# Altium schematic sheet LEDs.SchDoc
size A2
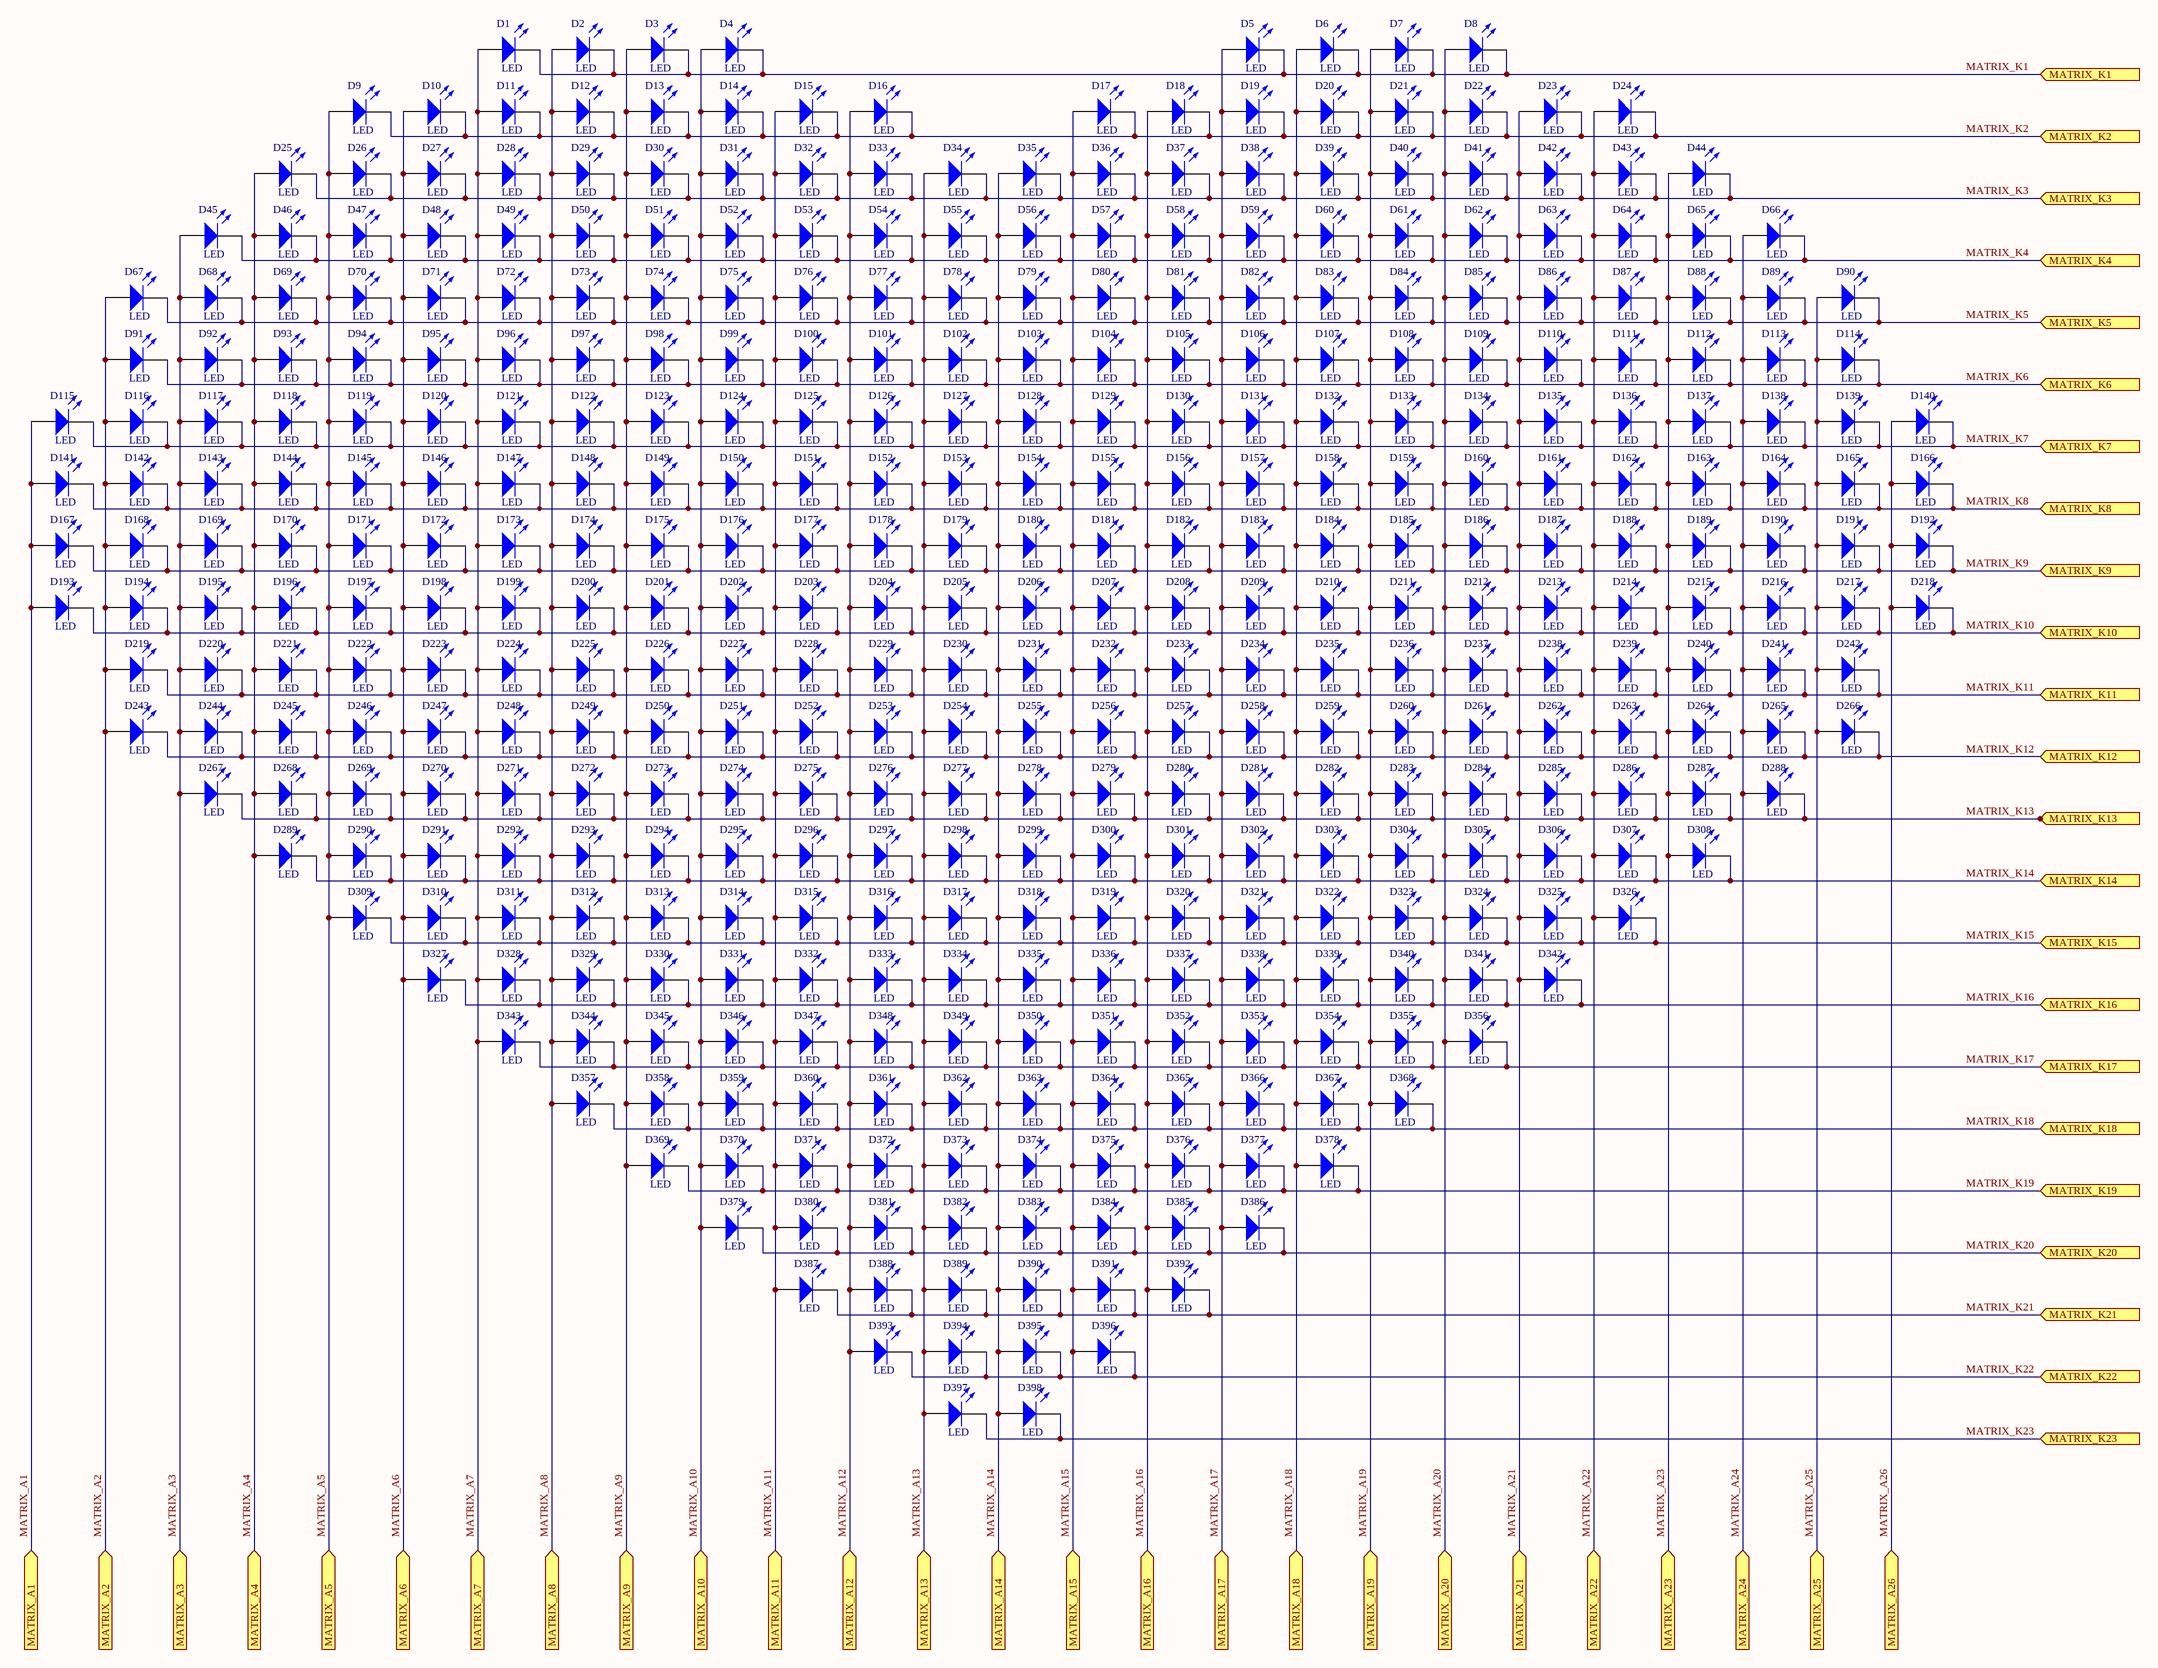
[diagram p0: LEDs.SchDoc]

## Parts
D1  LED  [led_3mm]
D2  LED  [led_3mm]
D3  LED  [led_3mm]
D4  LED  [led_3mm]
D5  LED  [led_3mm]
D6  LED  [led_3mm]
D7  LED  [led_3mm]
D8  LED  [led_3mm]
D9  LED  [led_3mm]
D10  LED  [led_3mm]
D11  LED  [led_3mm]
D12  LED  [led_3mm]
D13  LED  [led_3mm]
D14  LED  [led_3mm]
D15  LED  [led_3mm]
D16  LED  [led_3mm]
D17  LED  [led_3mm]
D18  LED  [led_3mm]
D19  LED  [led_3mm]
D20  LED  [led_3mm]
D21  LED  [led_3mm]
D22  LED  [led_3mm]
D23  LED  [led_3mm]
D24  LED  [led_3mm]
D25  LED  [led_3mm]
D26  LED  [led_3mm]
D27  LED  [led_3mm]
D28  LED  [led_3mm]
D29  LED  [led_3mm]
D30  LED  [led_3mm]
D31  LED  [led_3mm]
D32  LED  [led_3mm]
D33  LED  [led_3mm]
D34  LED  [led_3mm]
D35  LED  [led_3mm]
D36  LED  [led_3mm]
D37  LED  [led_3mm]
D38  LED  [led_3mm]
D39  LED  [led_3mm]
D40  LED  [led_3mm]
D41  LED  [led_3mm]
D42  LED  [led_3mm]
D43  LED  [led_3mm]
D44  LED  [led_3mm]
D45  LED  [led_3mm]
D46  LED  [led_3mm]
D47  LED  [led_3mm]
D48  LED  [led_3mm]
D49  LED  [led_3mm]
D50  LED  [led_3mm]
D51  LED  [led_3mm]
D52  LED  [led_3mm]
D53  LED  [led_3mm]
D54  LED  [led_3mm]
D55  LED  [led_3mm]
D56  LED  [led_3mm]
D57  LED  [led_3mm]
D58  LED  [led_3mm]
D59  LED  [led_3mm]
D60  LED  [led_3mm]
D61  LED  [led_3mm]
D62  LED  [led_3mm]
D63  LED  [led_3mm]
D64  LED  [led_3mm]
D65  LED  [led_3mm]
D66  LED  [led_3mm]
D67  LED  [led_3mm]
D68  LED  [led_3mm]
D69  LED  [led_3mm]
D70  LED  [led_3mm]
D71  LED  [led_3mm]
D72  LED  [led_3mm]
D73  LED  [led_3mm]
D74  LED  [led_3mm]
D75  LED  [led_3mm]
D76  LED  [led_3mm]
D77  LED  [led_3mm]
D78  LED  [led_3mm]
D79  LED  [led_3mm]
D80  LED  [led_3mm]
D81  LED  [led_3mm]
D82  LED  [led_3mm]
D83  LED  [led_3mm]
D84  LED  [led_3mm]
D85  LED  [led_3mm]
D86  LED  [led_3mm]
D87  LED  [led_3mm]
D88  LED  [led_3mm]
D89  LED  [led_3mm]
D90  LED  [led_3mm]
D91  LED  [led_3mm]
D92  LED  [led_3mm]
D93  LED  [led_3mm]
D94  LED  [led_3mm]
D95  LED  [led_3mm]
D96  LED  [led_3mm]
D97  LED  [led_3mm]
D98  LED  [led_3mm]
D99  LED  [led_3mm]
D100  LED  [led_3mm]
D101  LED  [led_3mm]
D102  LED  [led_3mm]
D103  LED  [led_3mm]
D104  LED  [led_3mm]
D105  LED  [led_3mm]
D106  LED  [led_3mm]
D107  LED  [led_3mm]
D108  LED  [led_3mm]
D109  LED  [led_3mm]
D110  LED  [led_3mm]
D111  LED  [led_3mm]
D112  LED  [led_3mm]
D113  LED  [led_3mm]
D114  LED  [led_3mm]
D115  LED  [led_3mm]
D116  LED  [led_3mm]
D117  LED  [led_3mm]
D118  LED  [led_3mm]
D119  LED  [led_3mm]
D120  LED  [led_3mm]
D121  LED  [led_3mm]
D122  LED  [led_3mm]
D123  LED  [led_3mm]
D124  LED  [led_3mm]
D125  LED  [led_3mm]
D126  LED  [led_3mm]
D127  LED  [led_3mm]
D128  LED  [led_3mm]
D129  LED  [led_3mm]
D130  LED  [led_3mm]
D131  LED  [led_3mm]
D132  LED  [led_3mm]
D133  LED  [led_3mm]
D134  LED  [led_3mm]
D135  LED  [led_3mm]
D136  LED  [led_3mm]
D137  LED  [led_3mm]
D138  LED  [led_3mm]
D139  LED  [led_3mm]
D140  LED  [led_3mm]
D141  LED  [led_3mm]
D142  LED  [led_3mm]
D143  LED  [led_3mm]
D144  LED  [led_3mm]
D145  LED  [led_3mm]
D146  LED  [led_3mm]
D147  LED  [led_3mm]
D148  LED  [led_3mm]
D149  LED  [led_3mm]
D150  LED  [led_3mm]
D151  LED  [led_3mm]
D152  LED  [led_3mm]
D153  LED  [led_3mm]
D154  LED  [led_3mm]
D155  LED  [led_3mm]
D156  LED  [led_3mm]
D157  LED  [led_3mm]
D158  LED  [led_3mm]
D159  LED  [led_3mm]
D160  LED  [led_3mm]
D161  LED  [led_3mm]
D162  LED  [led_3mm]
D163  LED  [led_3mm]
D164  LED  [led_3mm]
D165  LED  [led_3mm]
D166  LED  [led_3mm]
D167  LED  [led_3mm]
D168  LED  [led_3mm]
D169  LED  [led_3mm]
D170  LED  [led_3mm]
D171  LED  [led_3mm]
D172  LED  [led_3mm]
D173  LED  [led_3mm]
D174  LED  [led_3mm]
D175  LED  [led_3mm]
D176  LED  [led_3mm]
D177  LED  [led_3mm]
D178  LED  [led_3mm]
D179  LED  [led_3mm]
D180  LED  [led_3mm]
D181  LED  [led_3mm]
D182  LED  [led_3mm]
D183  LED  [led_3mm]
D184  LED  [led_3mm]
D185  LED  [led_3mm]
D186  LED  [led_3mm]
D187  LED  [led_3mm]
D188  LED  [led_3mm]
D189  LED  [led_3mm]
D190  LED  [led_3mm]
D191  LED  [led_3mm]
D192  LED  [led_3mm]
D193  LED  [led_3mm]
D194  LED  [led_3mm]
D195  LED  [led_3mm]
D196  LED  [led_3mm]
D197  LED  [led_3mm]
D198  LED  [led_3mm]
D199  LED  [led_3mm]
D200  LED  [led_3mm]
D201  LED  [led_3mm]
D202  LED  [led_3mm]
D203  LED  [led_3mm]
D204  LED  [led_3mm]
D205  LED  [led_3mm]
D206  LED  [led_3mm]
D207  LED  [led_3mm]
D208  LED  [led_3mm]
D209  LED  [led_3mm]
D210  LED  [led_3mm]
D211  LED  [led_3mm]
D212  LED  [led_3mm]
D213  LED  [led_3mm]
D214  LED  [led_3mm]
D215  LED  [led_3mm]
D216  LED  [led_3mm]
D217  LED  [led_3mm]
D218  LED  [led_3mm]
D219  LED  [led_3mm]
D220  LED  [led_3mm]
D221  LED  [led_3mm]
D222  LED  [led_3mm]
D223  LED  [led_3mm]
D224  LED  [led_3mm]
D225  LED  [led_3mm]
D226  LED  [led_3mm]
D227  LED  [led_3mm]
D228  LED  [led_3mm]
D229  LED  [led_3mm]
D230  LED  [led_3mm]
D231  LED  [led_3mm]
D232  LED  [led_3mm]
D233  LED  [led_3mm]
D234  LED  [led_3mm]
D235  LED  [led_3mm]
D236  LED  [led_3mm]
D237  LED  [led_3mm]
D238  LED  [led_3mm]
D239  LED  [led_3mm]
D240  LED  [led_3mm]
D241  LED  [led_3mm]
D242  LED  [led_3mm]
D243  LED  [led_3mm]
D244  LED  [led_3mm]
D245  LED  [led_3mm]
D246  LED  [led_3mm]
D247  LED  [led_3mm]
D248  LED  [led_3mm]
D249  LED  [led_3mm]
D250  LED  [led_3mm]
D251  LED  [led_3mm]
D252  LED  [led_3mm]
D253  LED  [led_3mm]
D254  LED  [led_3mm]
D255  LED  [led_3mm]
D256  LED  [led_3mm]
D257  LED  [led_3mm]
D258  LED  [led_3mm]
D259  LED  [led_3mm]
D260  LED  [led_3mm]
D261  LED  [led_3mm]
D262  LED  [led_3mm]
D263  LED  [led_3mm]
D264  LED  [led_3mm]
D265  LED  [led_3mm]
D266  LED  [led_3mm]
D267  LED  [led_3mm]
D268  LED  [led_3mm]
D269  LED  [led_3mm]
D270  LED  [led_3mm]
D271  LED  [led_3mm]
D272  LED  [led_3mm]
D273  LED  [led_3mm]
D274  LED  [led_3mm]
D275  LED  [led_3mm]
D276  LED  [led_3mm]
D277  LED  [led_3mm]
D278  LED  [led_3mm]
D279  LED  [led_3mm]
D280  LED  [led_3mm]
D281  LED  [led_3mm]
D282  LED  [led_3mm]
D283  LED  [led_3mm]
D284  LED  [led_3mm]
D285  LED  [led_3mm]
D286  LED  [led_3mm]
D287  LED  [led_3mm]
D288  LED  [led_3mm]
D289  LED  [led_3mm]
D290  LED  [led_3mm]
D291  LED  [led_3mm]
D292  LED  [led_3mm]
D293  LED  [led_3mm]
D294  LED  [led_3mm]
D295  LED  [led_3mm]
D296  LED  [led_3mm]
D297  LED  [led_3mm]
D298  LED  [led_3mm]
D299  LED  [led_3mm]
D300  LED  [led_3mm]
D301  LED  [led_3mm]
D302  LED  [led_3mm]
D303  LED  [led_3mm]
D304  LED  [led_3mm]
D305  LED  [led_3mm]
D306  LED  [led_3mm]
D307  LED  [led_3mm]
D308  LED  [led_3mm]
D309  LED  [led_3mm]
D310  LED  [led_3mm]
D311  LED  [led_3mm]
D312  LED  [led_3mm]
D313  LED  [led_3mm]
D314  LED  [led_3mm]
D315  LED  [led_3mm]
D316  LED  [led_3mm]
D317  LED  [led_3mm]
D318  LED  [led_3mm]
D319  LED  [led_3mm]
D320  LED  [led_3mm]
D321  LED  [led_3mm]
D322  LED  [led_3mm]
D323  LED  [led_3mm]
D324  LED  [led_3mm]
D325  LED  [led_3mm]
D326  LED  [led_3mm]
D327  LED  [led_3mm]
D328  LED  [led_3mm]
D329  LED  [led_3mm]
D330  LED  [led_3mm]
D331  LED  [led_3mm]
D332  LED  [led_3mm]
D333  LED  [led_3mm]
D334  LED  [led_3mm]
D335  LED  [led_3mm]
D336  LED  [led_3mm]
D337  LED  [led_3mm]
D338  LED  [led_3mm]
D339  LED  [led_3mm]
D340  LED  [led_3mm]
D341  LED  [led_3mm]
D342  LED  [led_3mm]
D343  LED  [led_3mm]
D344  LED  [led_3mm]
D345  LED  [led_3mm]
D346  LED  [led_3mm]
D347  LED  [led_3mm]
D348  LED  [led_3mm]
D349  LED  [led_3mm]
D350  LED  [led_3mm]
D351  LED  [led_3mm]
D352  LED  [led_3mm]
D353  LED  [led_3mm]
D354  LED  [led_3mm]
D355  LED  [led_3mm]
D356  LED  [led_3mm]
D357  LED  [led_3mm]
D358  LED  [led_3mm]
D359  LED  [led_3mm]
D360  LED  [led_3mm]
D361  LED  [led_3mm]
D362  LED  [led_3mm]
D363  LED  [led_3mm]
D364  LED  [led_3mm]
D365  LED  [led_3mm]
D366  LED  [led_3mm]
D367  LED  [led_3mm]
D368  LED  [led_3mm]
D369  LED  [led_3mm]
D370  LED  [led_3mm]
D371  LED  [led_3mm]
D372  LED  [led_3mm]
D373  LED  [led_3mm]
D374  LED  [led_3mm]
D375  LED  [led_3mm]
D376  LED  [led_3mm]
D377  LED  [led_3mm]
D378  LED  [led_3mm]
D379  LED  [led_3mm]
D380  LED  [led_3mm]
D381  LED  [led_3mm]
D382  LED  [led_3mm]
D383  LED  [led_3mm]
D384  LED  [led_3mm]
D385  LED  [led_3mm]
D386  LED  [led_3mm]
D387  LED  [led_3mm]
D388  LED  [led_3mm]
D389  LED  [led_3mm]
D390  LED  [led_3mm]
D391  LED  [led_3mm]
D392  LED  [led_3mm]
D393  LED  [led_3mm]
D394  LED  [led_3mm]
D395  LED  [led_3mm]
D396  LED  [led_3mm]
D397  LED  [led_3mm]
D398  LED  [led_3mm]

## Ports
MATRIX_A1 (in), MATRIX_A2 (in), MATRIX_A3 (in), MATRIX_A4 (in), MATRIX_A5 (in), MATRIX_A6 (in), MATRIX_A7 (in), MATRIX_A8 (in), MATRIX_A9 (in), MATRIX_A10 (in), MATRIX_A11 (in), MATRIX_A12 (in), MATRIX_A13 (in), MATRIX_A14 (in), MATRIX_A15 (in), MATRIX_A16 (in), MATRIX_A17 (in), MATRIX_A18 (in), MATRIX_A19 (in), MATRIX_A20 (in), MATRIX_A21 (in), MATRIX_A22 (in), MATRIX_A23 (in), MATRIX_A24 (in), MATRIX_A25 (in), MATRIX_A26 (in), MATRIX_K1 (in), MATRIX_K2 (in), MATRIX_K3 (in), MATRIX_K4 (in), MATRIX_K5 (in), MATRIX_K6 (in), MATRIX_K7 (in), MATRIX_K8 (in), MATRIX_K9 (in), MATRIX_K10 (in), MATRIX_K11 (in), MATRIX_K12 (in), MATRIX_K13 (in), MATRIX_K14 (in), MATRIX_K15 (in), MATRIX_K16 (in), MATRIX_K17 (in), MATRIX_K18 (in), MATRIX_K19 (in), MATRIX_K20 (in), MATRIX_K21 (in), MATRIX_K22 (in), MATRIX_K23 (in)

## Nets
MATRIX_A1: D115.A D141.A D167.A D193.A ; port MATRIX_A1
MATRIX_A2: D67.A D91.A D116.A D142.A D168.A D194.A D219.A D243.A ; port MATRIX_A2
MATRIX_A3: D45.A D68.A D92.A D117.A D143.A D169.A D195.A D220.A D244.A D267.A ; port MATRIX_A3
MATRIX_A4: D25.A D46.A D69.A D93.A D118.A D144.A D170.A D196.A D221.A D245.A D268.A D289.A ; port MATRIX_A4
MATRIX_A5: D9.A D26.A D47.A D70.A D94.A D119.A D145.A D171.A D197.A D222.A D246.A D269.A D290.A D309.A ; port MATRIX_A5
MATRIX_A6: D10.A D27.A D48.A D71.A D95.A D120.A D146.A D172.A D198.A D223.A D247.A D270.A D291.A D310.A D327.A ; port MATRIX_A6
MATRIX_A7: D1.A D11.A D28.A D49.A D72.A D96.A D121.A D147.A D173.A D199.A D224.A D248.A D271.A D292.A D311.A D328.A D343.A ; port MATRIX_A7
MATRIX_A8: D2.A D12.A D29.A D50.A D73.A D97.A D122.A D148.A D174.A D200.A D225.A D249.A D272.A D293.A D312.A D329.A D344.A D357.A ; port MATRIX_A8
MATRIX_A9: D3.A D13.A D30.A D51.A D74.A D98.A D123.A D149.A D175.A D201.A D226.A D250.A D273.A D294.A D313.A D330.A D345.A D358.A D369.A ; port MATRIX_A9
MATRIX_A10: D4.A D14.A D31.A D52.A D75.A D99.A D124.A D150.A D176.A D202.A D227.A D251.A D274.A D295.A D314.A D331.A D346.A D359.A D370.A D379.A ; port MATRIX_A10
MATRIX_A11: D15.A D32.A D53.A D76.A D100.A D125.A D151.A D177.A D203.A D228.A D252.A D275.A D296.A D315.A D332.A D347.A D360.A D371.A D380.A D387.A ; port MATRIX_A11
MATRIX_A12: D16.A D33.A D54.A D77.A D101.A D126.A D152.A D178.A D204.A D229.A D253.A D276.A D297.A D316.A D333.A D348.A D361.A D372.A D381.A D388.A D393.A ; port MATRIX_A12
MATRIX_A13: D34.A D55.A D78.A D102.A D127.A D153.A D179.A D205.A D230.A D254.A D277.A D298.A D317.A D334.A D349.A D362.A D373.A D382.A D389.A D394.A D397.A ; port MATRIX_A13
MATRIX_A14: D35.A D56.A D79.A D103.A D128.A D154.A D180.A D206.A D231.A D255.A D278.A D299.A D318.A D335.A D350.A D363.A D374.A D383.A D390.A D395.A D398.A ; port MATRIX_A14
MATRIX_A15: D17.A D36.A D57.A D80.A D104.A D129.A D155.A D181.A D207.A D232.A D256.A D279.A D300.A D319.A D336.A D351.A D364.A D375.A D384.A D391.A D396.A ; port MATRIX_A15
MATRIX_A16: D18.A D37.A D58.A D81.A D105.A D130.A D156.A D182.A D208.A D233.A D257.A D280.A D301.A D320.A D337.A D352.A D365.A D376.A D385.A D392.A ; port MATRIX_A16
MATRIX_A17: D5.A D19.A D38.A D59.A D82.A D106.A D131.A D157.A D183.A D209.A D234.A D258.A D281.A D302.A D321.A D338.A D353.A D366.A D377.A D386.A ; port MATRIX_A17
MATRIX_A18: D6.A D20.A D39.A D60.A D83.A D107.A D132.A D158.A D184.A D210.A D235.A D259.A D282.A D303.A D322.A D339.A D354.A D367.A D378.A ; port MATRIX_A18
MATRIX_A19: D7.A D21.A D40.A D61.A D84.A D108.A D133.A D159.A D185.A D211.A D236.A D260.A D283.A D304.A D323.A D340.A D355.A D368.A ; port MATRIX_A19
MATRIX_A20: D8.A D22.A D41.A D62.A D85.A D109.A D134.A D160.A D186.A D212.A D237.A D261.A D284.A D305.A D324.A D341.A D356.A ; port MATRIX_A20
MATRIX_A21: D23.A D42.A D63.A D86.A D110.A D135.A D161.A D187.A D213.A D238.A D262.A D285.A D306.A D325.A D342.A ; port MATRIX_A21
MATRIX_A22: D24.A D43.A D64.A D87.A D111.A D136.A D162.A D188.A D214.A D239.A D263.A D286.A D307.A D326.A ; port MATRIX_A22
MATRIX_A23: D44.A D65.A D88.A D112.A D137.A D163.A D189.A D215.A D240.A D264.A D287.A D308.A ; port MATRIX_A23
MATRIX_A24: D66.A D89.A D113.A D138.A D164.A D190.A D216.A D241.A D265.A D288.A ; port MATRIX_A24
MATRIX_A25: D90.A D114.A D139.A D165.A D191.A D217.A D242.A D266.A ; port MATRIX_A25
MATRIX_A26: D140.A D166.A D192.A D218.A ; port MATRIX_A26
MATRIX_K1: D1.K D2.K D3.K D4.K D5.K D6.K D7.K D8.K ; port MATRIX_K1
MATRIX_K2: D9.K D10.K D11.K D12.K D13.K D14.K D15.K D16.K D17.K D18.K D19.K D20.K D21.K D22.K D23.K D24.K ; port MATRIX_K2
MATRIX_K3: D25.K D26.K D27.K D28.K D29.K D30.K D31.K D32.K D33.K D34.K D35.K D36.K D37.K D38.K D39.K D40.K D41.K D42.K D43.K D44.K ; port MATRIX_K3
MATRIX_K4: D45.K D46.K D47.K D48.K D49.K D50.K D51.K D52.K D53.K D54.K D55.K D56.K D57.K D58.K D59.K D60.K D61.K D62.K D63.K D64.K D65.K D66.K ; port MATRIX_K4
MATRIX_K5: D67.K D68.K D69.K D70.K D71.K D72.K D73.K D74.K D75.K D76.K D77.K D78.K D79.K D80.K D81.K D82.K D83.K D84.K D85.K D86.K D87.K D88.K D89.K D90.K ; port MATRIX_K5
MATRIX_K6: D91.K D92.K D93.K D94.K D95.K D96.K D97.K D98.K D99.K D100.K D101.K D102.K D103.K D104.K D105.K D106.K D107.K D108.K D109.K D110.K D111.K D112.K D113.K D114.K ; port MATRIX_K6
MATRIX_K7: D115.K D116.K D117.K D118.K D119.K D120.K D121.K D122.K D123.K D124.K D125.K D126.K D127.K D128.K D129.K D130.K D131.K D132.K D133.K D134.K D135.K D136.K D137.K D138.K D139.K D140.K ; port MATRIX_K7
MATRIX_K8: D141.K D142.K D143.K D144.K D145.K D146.K D147.K D148.K D149.K D150.K D151.K D152.K D153.K D154.K D155.K D156.K D157.K D158.K D159.K D160.K D161.K D162.K D163.K D164.K D165.K D166.K ; port MATRIX_K8
MATRIX_K9: D167.K D168.K D169.K D170.K D171.K D172.K D173.K D174.K D175.K D176.K D177.K D178.K D179.K D180.K D181.K D182.K D183.K D184.K D185.K D186.K D187.K D188.K D189.K D190.K D191.K D192.K ; port MATRIX_K9
MATRIX_K10: D193.K D194.K D195.K D196.K D197.K D198.K D199.K D200.K D201.K D202.K D203.K D204.K D205.K D206.K D207.K D208.K D209.K D210.K D211.K D212.K D213.K D214.K D215.K D216.K D217.K D218.K ; port MATRIX_K10
MATRIX_K11: D219.K D220.K D221.K D222.K D223.K D224.K D225.K D226.K D227.K D228.K D229.K D230.K D231.K D232.K D233.K D234.K D235.K D236.K D237.K D238.K D239.K D240.K D241.K D242.K ; port MATRIX_K11
MATRIX_K12: D243.K D244.K D245.K D246.K D247.K D248.K D249.K D250.K D251.K D252.K D253.K D254.K D255.K D256.K D257.K D258.K D259.K D260.K D261.K D262.K D263.K D264.K D265.K D266.K ; port MATRIX_K12
MATRIX_K13: D267.K D268.K D269.K D270.K D271.K D272.K D273.K D274.K D275.K D276.K D277.K D278.K D279.K D280.K D281.K D282.K D283.K D284.K D285.K D286.K D287.K D288.K ; port MATRIX_K13
MATRIX_K14: D289.K D290.K D291.K D292.K D293.K D294.K D295.K D296.K D297.K D298.K D299.K D300.K D301.K D302.K D303.K D304.K D305.K D306.K D307.K D308.K ; port MATRIX_K14
MATRIX_K15: D309.K D310.K D311.K D312.K D313.K D314.K D315.K D316.K D317.K D318.K D319.K D320.K D321.K D322.K D323.K D324.K D325.K D326.K ; port MATRIX_K15
MATRIX_K16: D327.K D328.K D329.K D330.K D331.K D332.K D333.K D334.K D335.K D336.K D337.K D338.K D339.K D340.K D341.K D342.K ; port MATRIX_K16
MATRIX_K17: D343.K D344.K D345.K D346.K D347.K D348.K D349.K D350.K D351.K D352.K D353.K D354.K D355.K D356.K ; port MATRIX_K17
MATRIX_K18: D357.K D358.K D359.K D360.K D361.K D362.K D363.K D364.K D365.K D366.K D367.K D368.K ; port MATRIX_K18
MATRIX_K19: D369.K D370.K D371.K D372.K D373.K D374.K D375.K D376.K D377.K D378.K ; port MATRIX_K19
MATRIX_K20: D379.K D380.K D381.K D382.K D383.K D384.K D385.K D386.K ; port MATRIX_K20
MATRIX_K21: D387.K D388.K D389.K D390.K D391.K D392.K ; port MATRIX_K21
MATRIX_K22: D393.K D394.K D395.K D396.K ; port MATRIX_K22
MATRIX_K23: D397.K D398.K ; port MATRIX_K23

## Library data of the parts
D1-D398 = LED: Typical INFRARED GaAs LED; Published: 8-Jun-2000; LatestRevisionDate: 08-Jul-2005; LatestRevisionNote: Mech Layer 1 removed.; PackageReference: LED-0; Publisher: Altium Limited; PackageDescription: LED; 2 Leads